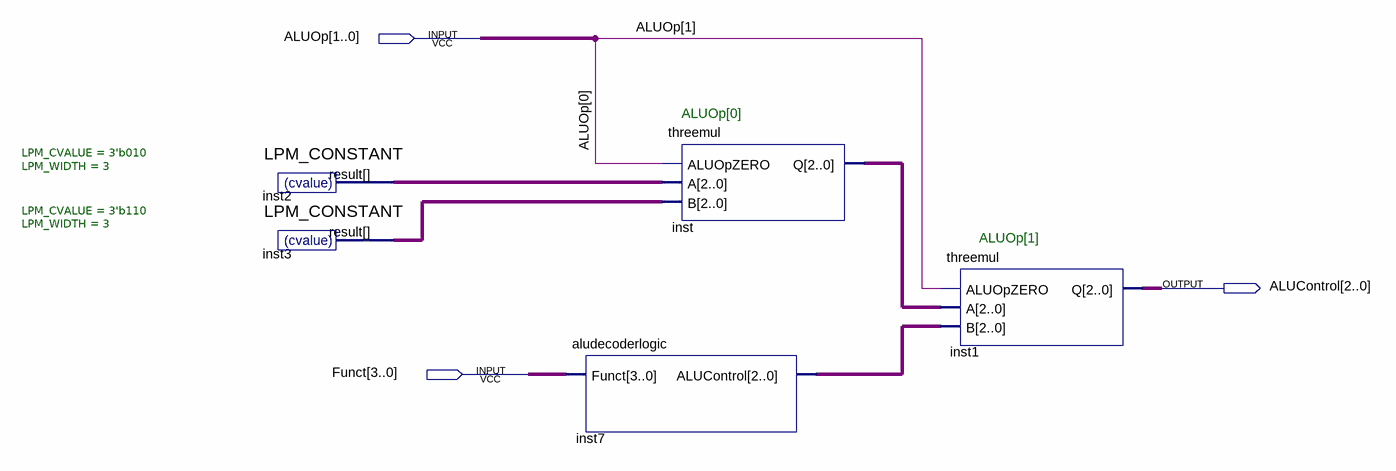
[diagram p0: schematic sheet]
// Quartus schematic aludecoder.bdf as structural Verilog: 5 symbols, 3 pins
module aludecoder (
  input  [1:0] ALUOp,
  input  [3:0] Funct,
  output [2:0] ALUControl
);

  wire [2:0] inst2_result, inst3_result, inst7_alucontrol, inst_q;

  LPM_CONSTANT #(.LPM_CVALUE(3'b010), .LPM_WIDTH(3)) inst2 (.result(inst2_result));
  LPM_CONSTANT #(.LPM_CVALUE(3'b110), .LPM_WIDTH(3)) inst3 (.result(inst3_result));
  aludecoderlogic inst7 (.Funct(Funct), .ALUControl(inst7_alucontrol));
  threemul inst (.ALUOpZERO(ALUOp[0]), .A(inst2_result), .B(inst3_result), .Q(inst_q));
  threemul inst1 (.ALUOpZERO(ALUOp[1]), .A(inst_q), .B(inst7_alucontrol), .Q(ALUControl));

  // Notes on the sheet:
  //   ALUOp[0]
  //   ALUOp[1]
endmodule
